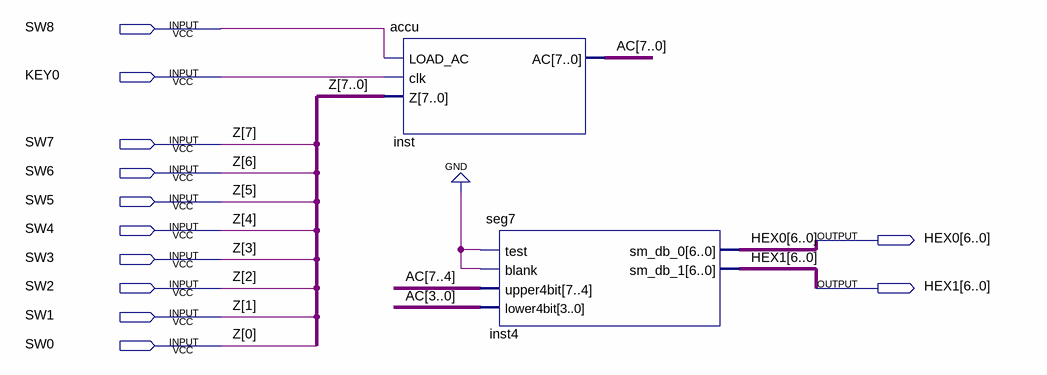
[diagram p0: schematic sheet]
// Quartus schematic accu_tb.bdf as structural Verilog: 2 symbols, 12 pins
module accu_tb (
  input  SW8,
  input  KEY0,
  input  SW7,
  input  SW6,
  input  SW5,
  input  SW4,
  input  SW3,
  input  SW2,
  input  SW1,
  input  SW0,
  output [6:0] HEX0,
  output [6:0] HEX1
);

  wire [7:0] AC;

  accu inst (.LOAD_AC(SW8), .clk(KEY0), .Z({SW7, SW6, SW5, SW4, SW3, SW2, SW1, SW0}), .AC(AC));
  seg7 inst4 (.test(1'b0), .blank(1'b0), .upper4bit(AC[7:4]), .lower4bit(AC[3:0]), .sm_db_0(HEX0), .sm_db_1(HEX1));

  // Other names for the same wires on the sheet: Z[7:0] = {SW7, SW6, SW5, SW4, SW3, SW2, SW1, SW0}
endmodule
